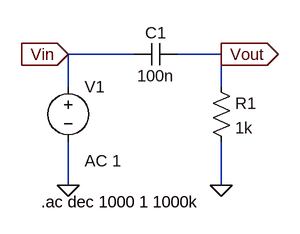
[diagram p0: schematic Filters - Passive RC High Pass Filter - 1st order.asc]
Filters - Passive RC High Pass Filter - 1st order.asc, the LTspice schematic file:
Version 4.1
SHEET 1 880 680
WIRE 208 96 112 96
WIRE 336 96 272 96
WIRE 112 144 112 96
WIRE 336 144 336 96
WIRE 112 288 112 224
WIRE 336 288 336 224
FLAG 112 288 0
FLAG 336 288 0
FLAG 112 96 Vin
IOPIN 112 96 In
FLAG 336 96 Vout
IOPIN 336 96 Out
SYMBOL voltage 112 128 R0
WINDOW 123 24 124 Left 2
WINDOW 39 0 0 Left 0
SYMATTR InstName V1
SYMATTR Value ""
SYMATTR Value2 AC 1
SYMBOL res 320 128 R0
SYMATTR InstName R1
SYMATTR Value 1k
SYMBOL cap 272 80 R90
WINDOW 0 0 32 VBottom 2
WINDOW 3 32 32 VTop 2
SYMATTR InstName C1
SYMATTR Value 100n
TEXT 72 312 Left 2 !.ac dec 1000 1 1000k

The netlist it stands for:
* Filters - Passive RC High Pass Filter - 1st order.asc
V1 Vin 0 AC 1
R1 Vout 0 1k
C1 Vout Vin 100n
.ac dec 1000 1 1000k
.backanno
.end